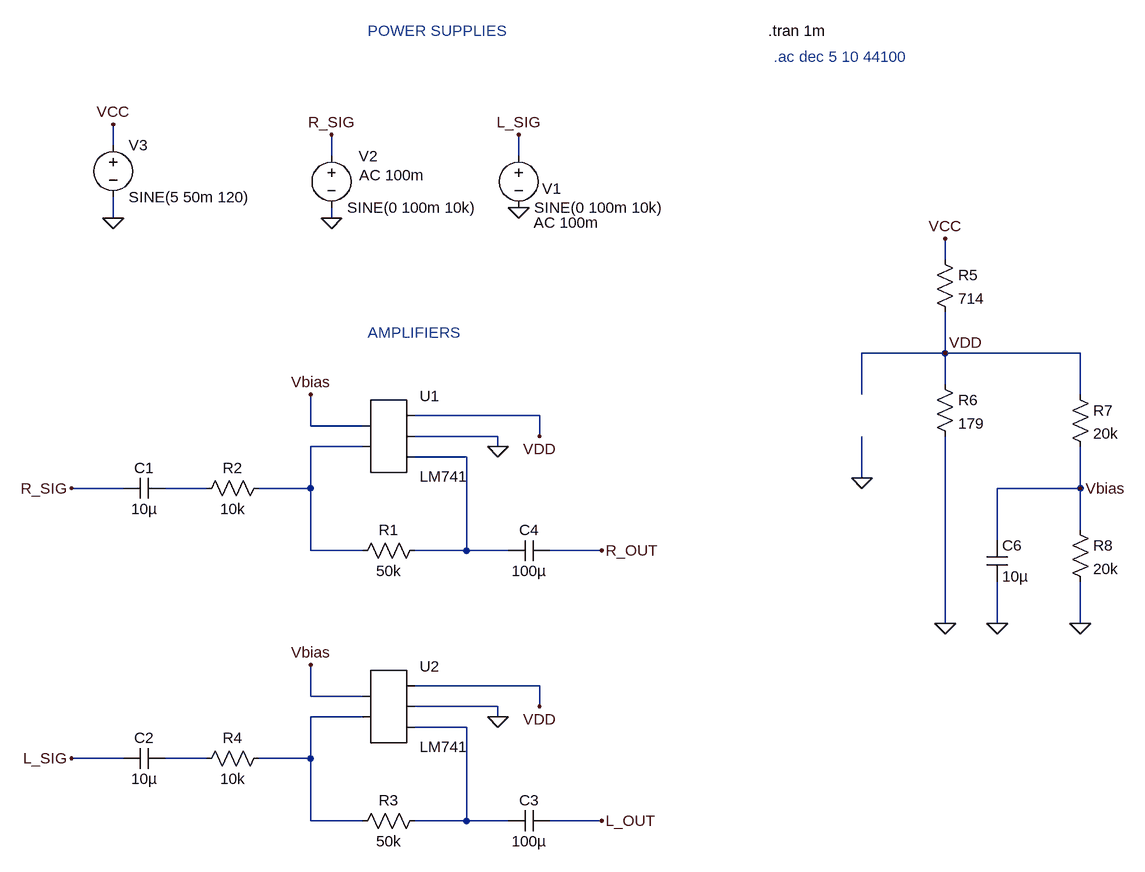
[diagram p0: schematic Amplifier.asc]
Amplifier.asc, the LTspice schematic file:
Version 4
SHEET 1 880 680
WIRE -880 -544 -880 -576
WIRE -544 -528 -544 -560
WIRE -256 -528 -256 -560
WIRE -880 -432 -880 -464
WIRE -544 -432 -544 -448
WIRE 400 -368 400 -400
WIRE 400 -224 400 -288
WIRE 400 -224 272 -224
WIRE 608 -224 400 -224
WIRE 400 -176 400 -224
WIRE 272 -160 272 -224
WIRE 608 -160 608 -224
WIRE -224 -128 -416 -128
WIRE -576 -112 -576 -160
WIRE -496 -112 -576 -112
WIRE -288 -96 -416 -96
WIRE -224 -96 -224 -128
WIRE -496 -80 -576 -80
WIRE -288 -80 -288 -96
WIRE -336 -64 -416 -64
WIRE 272 -32 272 -96
WIRE -864 -16 -944 -16
WIRE -736 -16 -800 -16
WIRE -576 -16 -576 -80
WIRE -576 -16 -656 -16
WIRE 608 -16 608 -80
WIRE 608 -16 480 -16
WIRE 608 48 608 -16
WIRE 480 64 480 -16
WIRE -576 80 -576 -16
WIRE -496 80 -576 80
WIRE -336 80 -336 -64
WIRE -336 80 -416 80
WIRE -272 80 -336 80
WIRE -128 80 -208 80
WIRE 400 192 400 -96
WIRE 480 192 480 128
WIRE 608 192 608 128
WIRE -224 288 -416 288
WIRE -576 304 -576 256
WIRE -496 304 -576 304
WIRE -288 320 -416 320
WIRE -224 320 -224 288
WIRE -496 336 -576 336
WIRE -288 336 -288 320
WIRE -336 352 -416 352
WIRE -864 400 -944 400
WIRE -736 400 -800 400
WIRE -576 400 -576 336
WIRE -576 400 -656 400
WIRE -576 496 -576 400
WIRE -496 496 -576 496
WIRE -336 496 -336 352
WIRE -336 496 -416 496
WIRE -272 496 -336 496
WIRE -128 496 -208 496
FLAG -944 -16 R_SIG
FLAG -288 -80 0
FLAG -128 80 R_OUT
FLAG -944 400 L_SIG
FLAG -288 336 0
FLAG -128 496 L_OUT
FLAG -224 -96 VDD
FLAG -224 320 VDD
FLAG -256 -448 0
FLAG -256 -560 L_SIG
FLAG -544 -560 R_SIG
FLAG -544 -432 0
FLAG -576 -160 Vbias
FLAG -576 256 Vbias
FLAG 272 -32 0
FLAG 480 192 0
FLAG 400 192 0
FLAG 608 192 0
FLAG -880 -432 0
FLAG -880 -576 VCC
FLAG 608 -16 Vbias
FLAG 400 -224 VDD
FLAG 400 -400 VCC
SYMBOL cap -800 -32 R90
WINDOW 0 0 32 VBottom 2
WINDOW 3 32 32 VTop 2
SYMATTR InstName C1
SYMATTR Value 10µ
SYMBOL AutoGenerated\\LM741 -464 -96 R0
SYMATTR InstName U1
SYMBOL res -400 64 R90
WINDOW 0 0 56 VBottom 2
WINDOW 3 32 56 VTop 2
SYMATTR InstName R1
SYMATTR Value 50k
SYMBOL res -640 -32 R90
WINDOW 0 0 56 VBottom 2
WINDOW 3 32 56 VTop 2
SYMATTR InstName R2
SYMATTR Value 10k
SYMBOL cap -800 384 R90
WINDOW 0 0 32 VBottom 2
WINDOW 3 32 32 VTop 2
SYMATTR InstName C2
SYMATTR Value 10µ
SYMBOL AutoGenerated\\LM741 -464 320 R0
SYMATTR InstName U2
SYMBOL res -400 480 R90
WINDOW 0 0 56 VBottom 2
WINDOW 3 32 56 VTop 2
SYMATTR InstName R3
SYMATTR Value 50k
SYMBOL res -640 384 R90
WINDOW 0 0 56 VBottom 2
WINDOW 3 32 56 VTop 2
SYMATTR InstName R4
SYMATTR Value 10k
SYMBOL cap -208 480 R90
WINDOW 0 0 32 VBottom 2
WINDOW 3 32 32 VTop 2
SYMATTR InstName C3
SYMATTR Value 100µ
SYMBOL cap -208 64 R90
WINDOW 0 0 32 VBottom 2
WINDOW 3 32 32 VTop 2
SYMATTR InstName C4
SYMATTR Value 100µ
SYMBOL voltage -256 -544 R0
WINDOW 123 23 119 Left 2
WINDOW 39 0 0 Left 0
WINDOW 0 36 67 Left 2
SYMATTR Value2 AC 100m
SYMATTR InstName V1
SYMATTR Value SINE(0 100m 10k)
SYMBOL voltage -544 -544 R0
WINDOW 123 43 46 Left 2
WINDOW 39 0 0 Left 0
WINDOW 0 42 17 Left 2
SYMATTR Value2 AC 100m
SYMATTR InstName V2
SYMATTR Value SINE(0 100m 10k)
SYMBOL res 384 -384 R0
SYMATTR InstName R5
SYMATTR Value 714
SYMBOL res 384 -192 R0
SYMATTR InstName R6
SYMATTR Value 179
SYMBOL res 592 -176 R0
SYMATTR InstName R7
SYMATTR Value 20k
SYMBOL res 592 32 R0
SYMATTR InstName R8
SYMATTR Value 20k
SYMBOL cap 464 64 R0
SYMATTR InstName C6
SYMATTR Value 10µ
SYMBOL voltage -880 -560 R0
WINDOW 123 0 0 Left 0
WINDOW 39 0 0 Left 0
SYMATTR InstName V3
SYMATTR Value SINE(5 50m 120)
TEXT -488 -256 Left 2 ;AMPLIFIERS
TEXT 128 -720 Left 2 !.tran 1m
TEXT 136 -680 Left 2 ;.ac dec 5 10 44100
TEXT -488 -720 Left 2 ;POWER SUPPLIES

The netlist it stands for:
* Amplifier.asc
C1 N003 R_SIG 10µ
* U1: LM741 (symbol AutoGenerated\LM741 not available, pins judged from their places): pin1=Vbias pin2=N001 pin3=VDD pin4=0 pin5=N002
R1 N002 N001 50k
R2 N001 N003 10k
C2 N006 L_SIG 10µ
* U2: LM741 (symbol AutoGenerated\LM741 not available, pins judged from their places): pin1=Vbias pin2=N004 pin3=VDD pin4=0 pin5=N005
R3 N005 N004 50k
R4 N004 N006 10k
C3 L_OUT N005 100µ
C4 R_OUT N002 100µ
V1 L_SIG 0 SINE(0 100m 10k) AC 100m
V2 R_SIG 0 SINE(0 100m 10k) AC 100m
R5 VCC VDD 714
R6 VDD 0 179
R7 VDD Vbias 20k
R8 Vbias 0 20k
C6 Vbias 0 10µ
V3 VCC 0 SINE(5 50m 120)
* AMPLIFIERS
.tran 1m
* .ac dec 5 10 44100
* POWER SUPPLIES
.backanno
.end